# EAGLE design PSPS_AVNC_SRD_central-2020-10-21 (FABRICATED) (EAGLE 9.6.2)
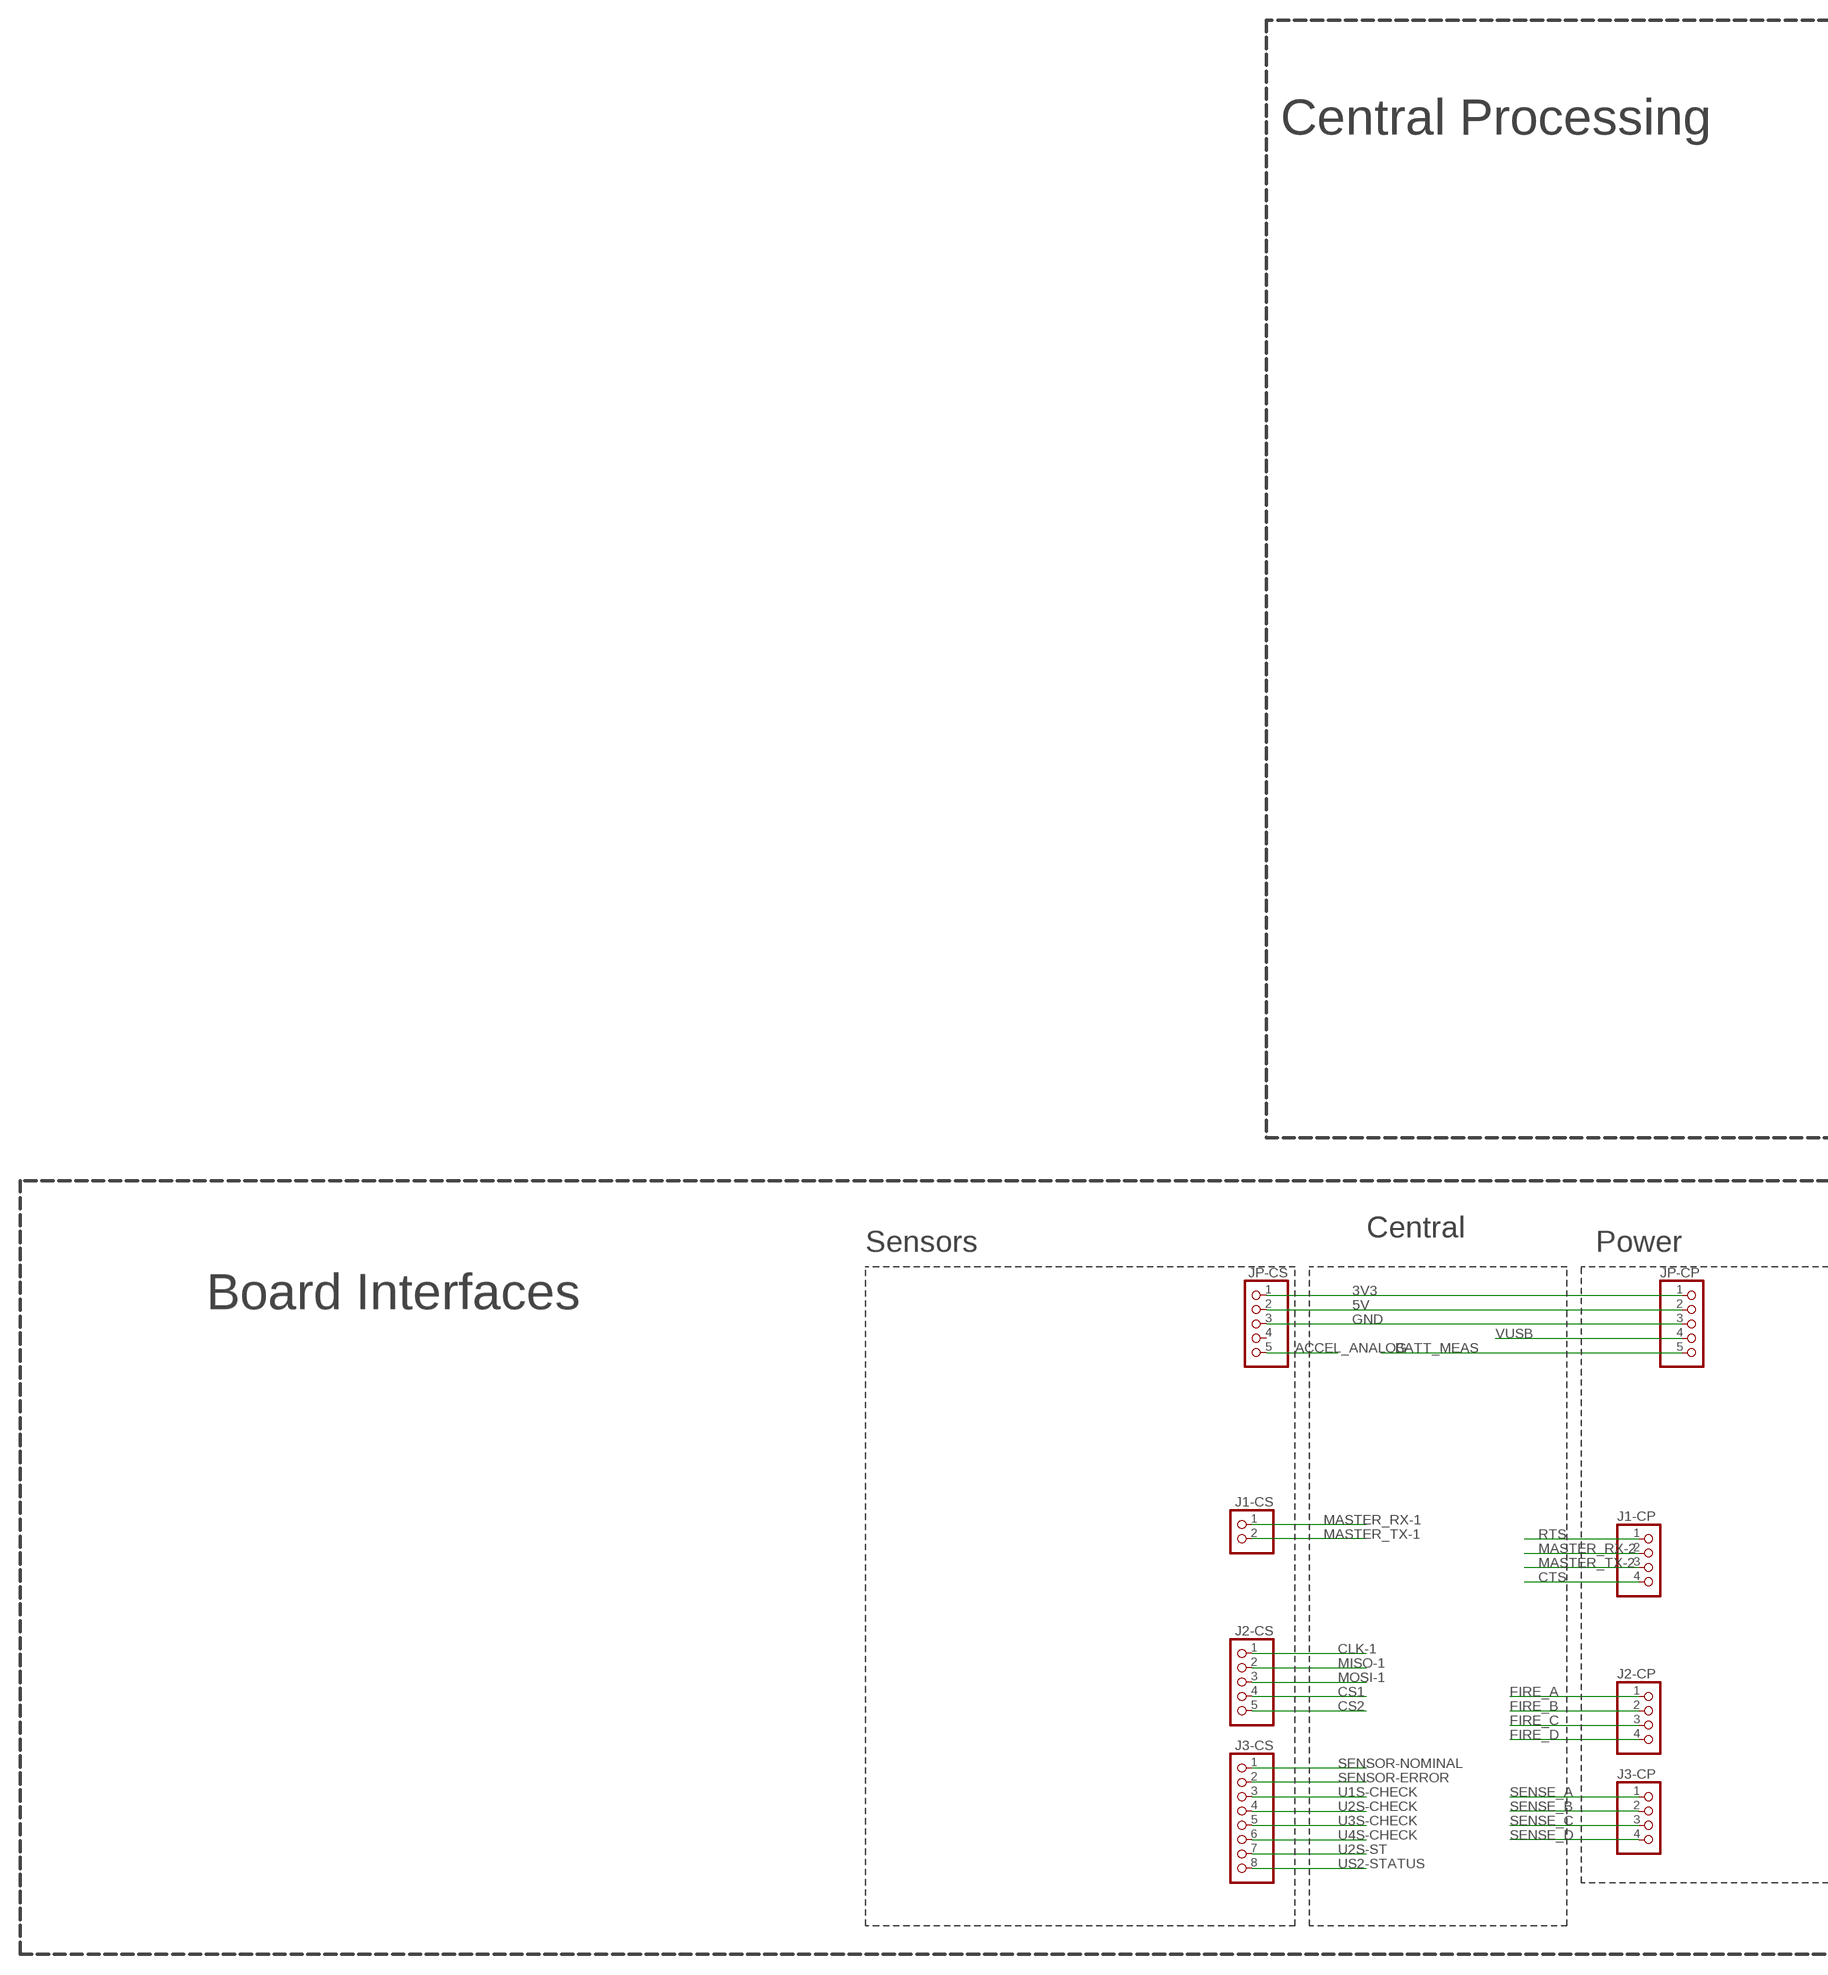
[diagram p0: schematic, sheet 1, part 1 of 2]
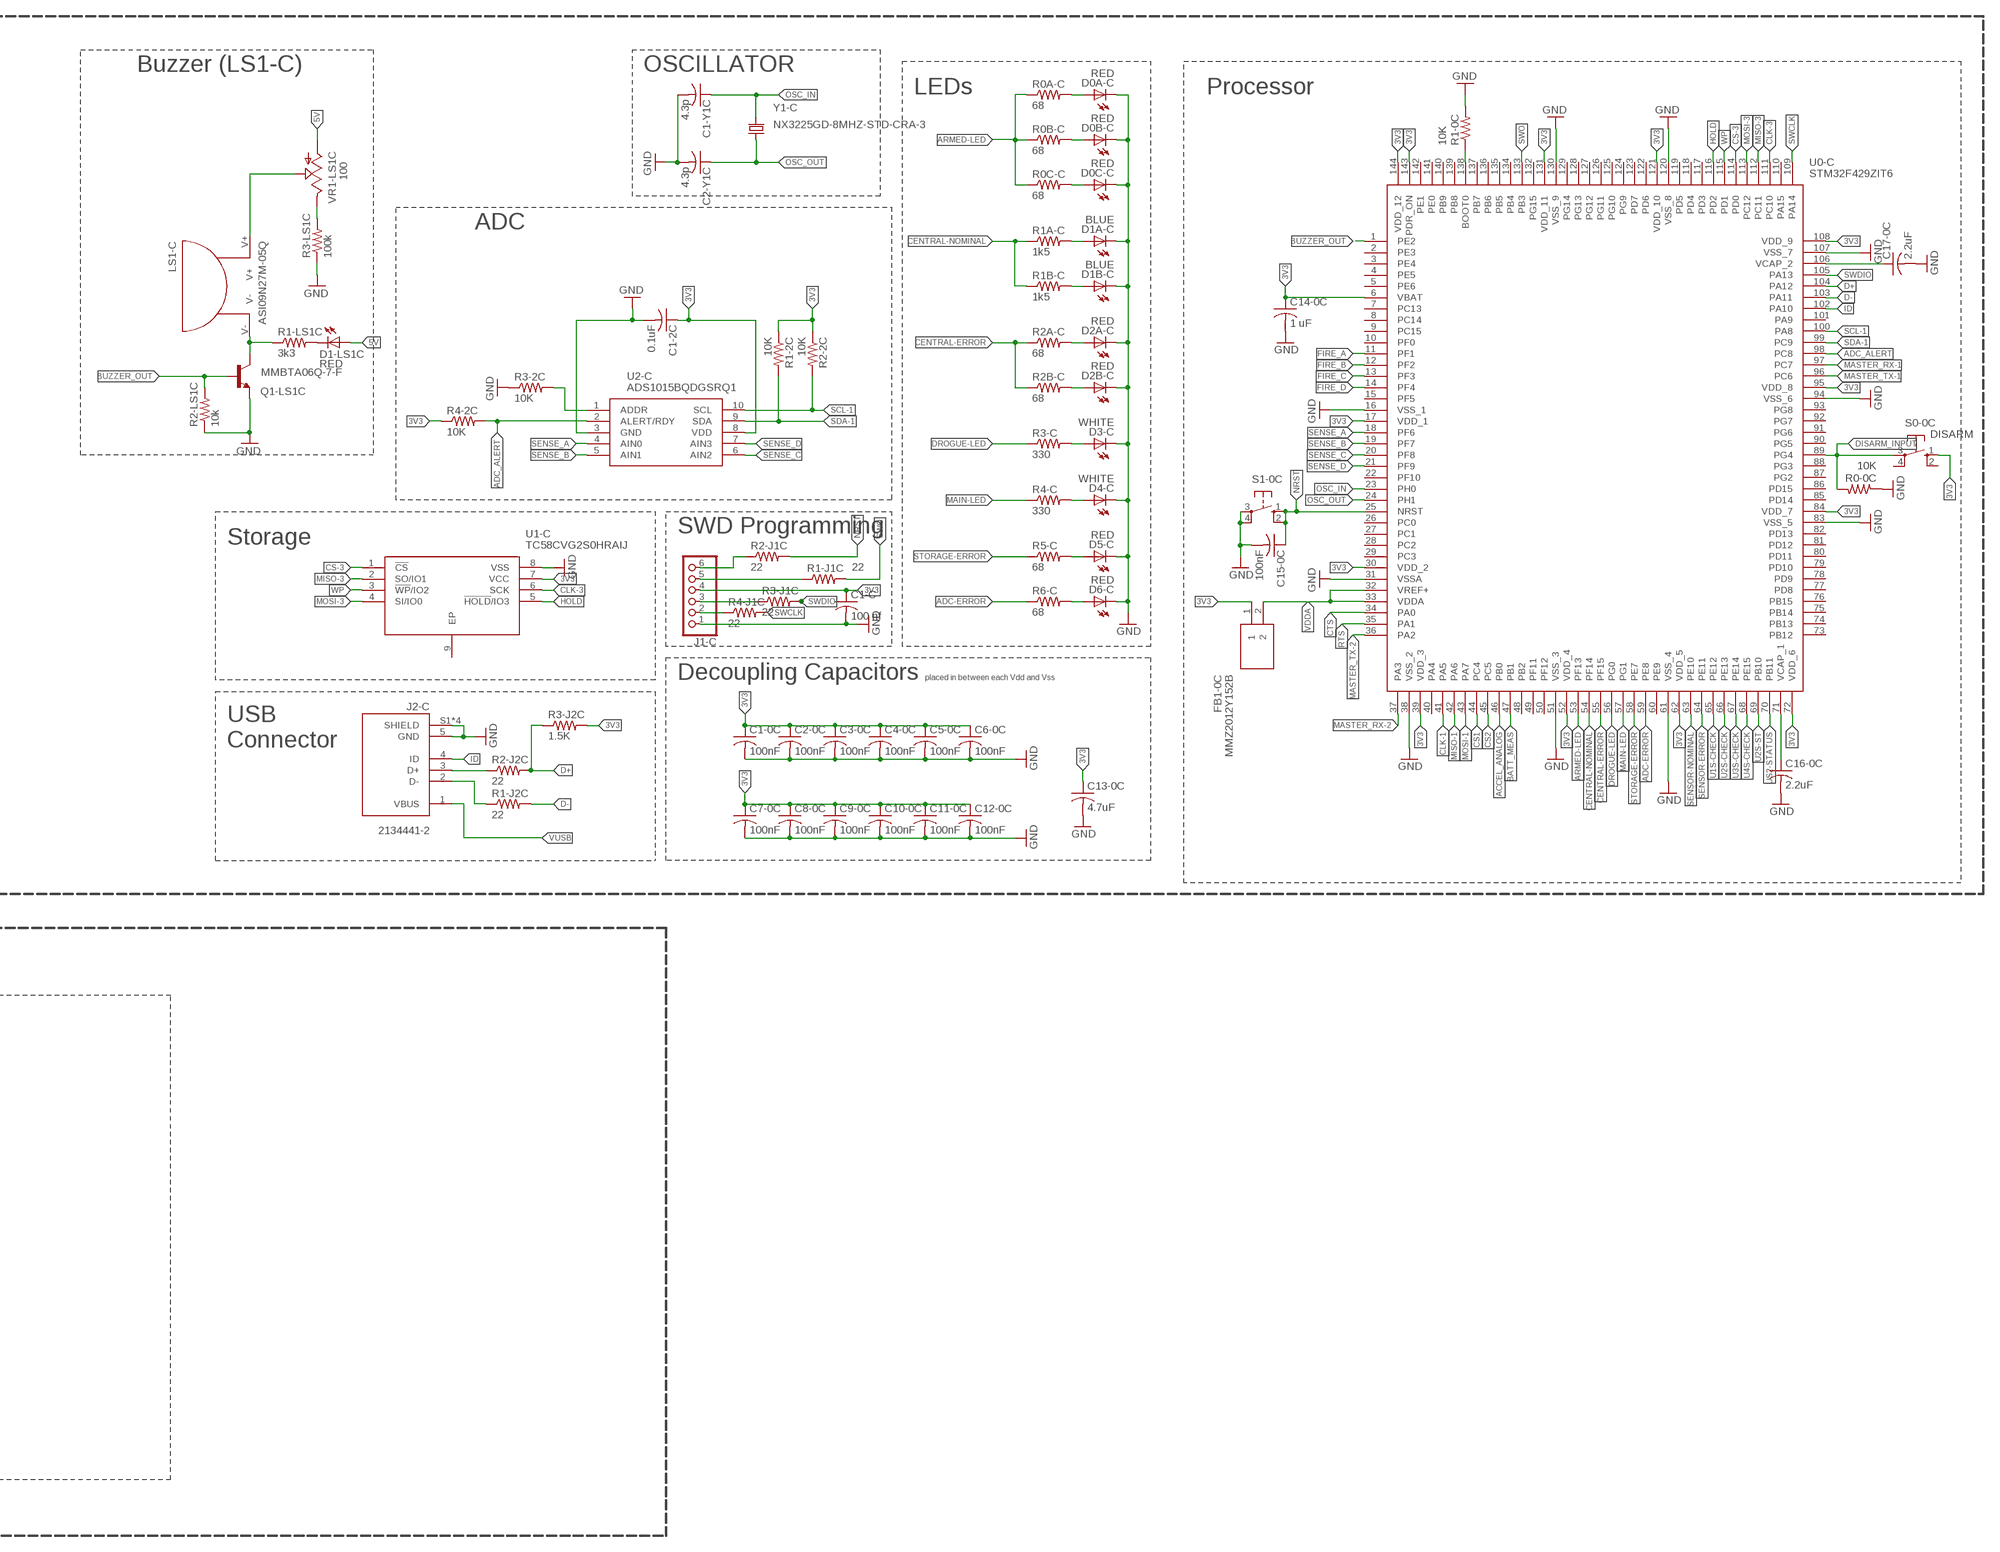
[diagram p1: schematic, sheet 1, part 2 of 2]

## Parts
C1-0C  100nF  C-USC0805  [C0805]
C1-2C  0.1uF  C-USC0805  [C0805]
C1-C  100 nf  C-USC0805  [C0805]
C1-Y1C  4.3p  C-USC0805  [C0805]
C2-0C  100nF  C-USC0805  [C0805]
C2-Y1C  4.3p  C-USC0805  [C0805]
C3-0C  100nF  C-USC0805  [C0805]
C4-0C  100nF  C-USC0805  [C0805]
C5-0C  100nF  C-USC0805  [C0805]
C6-0C  100nF  C-USC0805  [C0805]
C7-0C  100nF  C-USC0805  [C0805]
C8-0C  100nF  C-USC0805  [C0805]
C9-0C  100nF  C-USC0805  [C0805]
C10-0C  100nF  C-USC0805  [C0805]
C11-0C  100nF  C-USC0805  [C0805]
C12-0C  100nF  C-USC0805  [C0805]
C13-0C  4.7uF  C-USC0805  [C0805]
C14-0C  1 uF  C-USC0805  [C0805]
C15-0C  100nF  C-USC0805  [C0805]
C16-0C  2.2uF  C-USC0805  [C0805]
C17-0C  2.2uF  C-USC0805  [C0805]
D0A-C  RED  LEDCHIPLED_0805  [CHIPLED_0805]
D0B-C  RED  LEDCHIPLED_0805  [CHIPLED_0805]
D0C-C  RED  LEDCHIPLED_0805  [CHIPLED_0805]
D1-LS1C  RED  LEDCHIPLED_0805  [CHIPLED_0805]
D1A-C  BLUE  LEDCHIPLED_0805  [CHIPLED_0805]
D1B-C  BLUE  LEDCHIPLED_0805  [CHIPLED_0805]
D2A-C  RED  LEDCHIPLED_0805  [CHIPLED_0805]
D2B-C  RED  LEDCHIPLED_0805  [CHIPLED_0805]
D3-C  WHITE  LEDCHIPLED_0805  [CHIPLED_0805]
D4-C  WHITE  LEDCHIPLED_0805  [CHIPLED_0805]
D5-C  RED  LEDCHIPLED_0805  [CHIPLED_0805]
D6-C  RED  LEDCHIPLED_0805  [CHIPLED_0805]
FB1-0C  MMZ2012Y152B  [BEADC2012X105N]
J1-C  PINHD-1X6  [1X06]
J1-CP  PINHD-1X4  [1X04]
J1-CS  PINHD-1X2  [1X02]
J2-C  2134441-2  [TE_2134441-2]
J2-CP  PINHD-1X4  [1X04]
J2-CS  PINHD-1X5  [1X05]
J3-CP  PINHD-1X4  [1X04]
J3-CS  PINHD-1X8  [1X08]
JP-CP  PINHD-1X5  [1X05]
JP-CS  PINHD-1X5  [1X05]
LS1-C  ASI09N27M-05Q  [ASI09N27M-05Q]
Q1-LS1C  MMBTA06Q-7-F  NPN_TRANSISTOR  [SOT23]
R0-0C  10K  R-US_R0805  [R0805]
R0A-C  68  R-US_M0805  [M0805]
R0B-C  68  R-US_M0805  [M0805]
R0C-C  68  R-US_M0805  [M0805]
R1-0C  10K  R-US_R0805  [R0805]
R1-2C  10K  R-US_R0805  [R0805]
R1-J1C  22  R-US_M0805  [M0805]
R1-J2C  22  R-US_M0805  [M0805]
R1-LS1C  3k3  R-US_R0805  [R0805]
R1A-C  1k5  R-US_M0805  [M0805]
R1B-C  1k5  R-US_M0805  [M0805]
R2-2C  10K  R-US_R0805  [R0805]
R2-J1C  22  R-US_M0805  [M0805]
R2-J2C  22  R-US_M0805  [M0805]
R2-LS1C  10k  R-US_R0805  [R0805]
R2A-C  68  R-US_M0805  [M0805]
R2B-C  68  R-US_M0805  [M0805]
R3-2C  10K  R-US_R0805  [R0805]
R3-C  330  R-US_M0805  [M0805]
R3-J1C  22  R-US_M0805  [M0805]
R3-J2C  1.5K  R-US_M0805  [M0805]
R3-LS1C  100k  R-US_R0805  [R0805]
R4-2C  10K  R-US_R0805  [R0805]
R4-C  330  R-US_M0805  [M0805]
R4-J1C  22  R-US_M0805  [M0805]
R5-C  68  R-US_M0805  [M0805]
R6-C  68  R-US_M0805  [M0805]
S0-0C  DISARM  10-XX  [B3F-10XX]
S1-0C  10-XX  [B3F-10XX]
U0-C  STM32F429ZIT6  [QFP50P2200X2200X160-144N]
U1-C  TC58CVG2S0HRAIJ  [SON127P800X600X80-9N]
U2-C  ADS1015BQDGSRQ1  [SOP50P490X110-10N]
VR1-LS1C  100  TRIM_US-LI10  [LI10]
Y1-C  NX3225GD-8MHZ-STD-CRA-3  NX3225GD  [NX3225GD]

## Nets
3V3: C1-0C.1 C1-2C.1 C1-C.1 C2-0C.1 C3-0C.1 C4-0C.1 C5-0C.1 C6-0C.1 C7-0C.1 C8-0C.1 C9-0C.1 C10-0C.1 C11-0C.1 C12-0C.1 C13-0C.1 C14-0C.1 FB1-0C.1 J1-C.4 JP-CP.1 JP-CS.1 R1-2C.1 R2-2C.1 R3-J2C.2 R4-2C.1 S0-0C.1(S) U0-C.6(VBAT) U0-C.17(VDD_1) U0-C.30(VDD_2) U0-C.39(VDD_3) U0-C.52(VDD_4) U0-C.62(VDD_5) U0-C.72(VDD_6) U0-C.84(VDD_7) U0-C.95(VDD_8) U0-C.108(VDD_9) U0-C.121(VDD_10) U0-C.131(VDD_11) U0-C.143(PDR_ON) U0-C.144(VDD_12) U1-C.7(VCC) U2-C.8(VDD)
5V: D1-LS1C.A JP-CP.2 JP-CS.2 VR1-LS1C.A
ACCEL_ANALOG: JP-CS.5 U0-C.46(PB0)
ADC-ERROR: R6-C.1 U0-C.59(PE8)
ADC_ALERT: R4-2C.2 U0-C.98(PC8) U2-C.2(ALERT/RDY)
ADDR: R3-2C.2 U2-C.1(ADDR)
ARMED-LED: R0A-C.1 R0B-C.1 R0C-C.1 U0-C.53(PF13)
BATT_MEAS: JP-CP.5 U0-C.47(PB1)
BOOT0: R1-0C.1 U0-C.138(BOOT0)
BUZZER_OUT: Q1-LS1C.1(B) R2-LS1C.2 U0-C.1(PE2)
CENTRAL-ERROR: R2A-C.1 R2B-C.1 U0-C.55(PF15)
CENTRAL-NOMINAL: R1A-C.1 R1B-C.1 U0-C.54(PF14)
CLK-1: J2-CS.1 U0-C.41(PA5)
CLK-3: U0-C.111(PC10) U1-C.6(SCK)
CS1: J2-CS.4 U0-C.44(PC4)
CS2: J2-CS.5 U0-C.45(PC5)
CS-3: U0-C.114(PD0) U1-C.1(!CS)
CTS: J1-CP.4 U0-C.34(PA0)
D1-LS1C_R1-LS1C: D1-LS1C.C R1-LS1C.2
D+: R2-J2C.2 R3-J2C.1 U0-C.104(PA12)
D+_R2-J1C: J2-C.3(D+) R2-J2C.1
D-: R1-J2C.2 U0-C.103(PA11)
D-_R1-J1C: J2-C.2(D-) R1-J2C.1
DISARM_INPUT: R0-0C.2 S0-0C.3(P) U0-C.89(PG4)
DROGUE-LED: R3-C.1 U0-C.56(PG0)
FIRE_A: J2-CP.1 U0-C.11(PF1)
FIRE_B: J2-CP.2 U0-C.12(PF2)
FIRE_C: J2-CP.3 U0-C.13(PF3)
FIRE_D: J2-CP.4 U0-C.14(PF4)
GND: C1-0C.2 C1-2C.2 C1-C.2 C1-Y1C.2 C2-0C.2 C2-Y1C.2 C3-0C.2 C4-0C.2 C5-0C.2 C6-0C.2 C7-0C.2 C8-0C.2 C9-0C.2 C10-0C.2 C11-0C.2 C12-0C.2 C13-0C.2 C14-0C.2 C15-0C.2 C16-0C.2 C17-0C.2 D0A-C.C D0B-C.C D0C-C.C D1A-C.C D1B-C.C D2A-C.C D2B-C.C D3-C.C D4-C.C D5-C.C D6-C.C J1-C.1 J2-C.5(GND) J2-C.S1(SHIELD) J2-C.S2(SHIELD) J2-C.S3(SHIELD) J2-C.S4(SHIELD) JP-CP.3 JP-CS.3 Q1-LS1C.3(E) R0-0C.1 R1-0C.2 R2-LS1C.1 R3-2C.1 R3-LS1C.1 S1-0C.3(P) S1-0C.4(P1) U0-C.16(VSS_1) U0-C.31(VSSA) U0-C.38(VSS_2) U0-C.51(VSS_3) U0-C.61(VSS_4) U0-C.83(VSS_5) U0-C.94(VSS_6) U0-C.107(VSS_7) U0-C.120(VSS_8) U0-C.130(VSS_9) U1-C.8(VSS) U2-C.3(GND)
HOLD: U0-C.116(PD2) U1-C.5(!HOLD!/IO3)
ID: J2-C.4(ID) U0-C.102(PA10)
J1-C_R1-J1C: J1-C.5 R1-J1C.1
J1-C_R2-J1C: J1-C.6 R2-J1C.1
J1-C_R3-J1C: J1-C.3 R3-J1C.1
J1-C_R4-J1C: J1-C.2 R4-J1C.1
LS1-C_Q1-LS1C: LS1-C.V- Q1-LS1C.2(C) R1-LS1C.1
MAIN-LED: R4-C.1 U0-C.57(PG1)
MASTER_RX-1: J1-CS.1 U0-C.97(PC7)
MASTER_RX-2: J1-CP.2 U0-C.37(PA3)
MASTER_TX-1: J1-CS.2 U0-C.96(PC6)
MASTER_TX-2: J1-CP.3 U0-C.36(PA2)
MISO-1: J2-CS.2 U0-C.42(PA6)
MISO-3: U0-C.112(PC11) U1-C.2(SO/IO1)
MOSI-1: J2-CS.3 U0-C.43(PA7)
MOSI-3: U0-C.113(PC12) U1-C.4(SI/IO0)
NRST: C15-0C.1 R2-J1C.2 S1-0C.1(S) S1-0C.2(S1) U0-C.25(NRST)
OSC_IN: C1-Y1C.1 U0-C.23(PH0) Y1-C.P$2
OSC_OUT: C2-Y1C.1 U0-C.24(PH1) Y1-C.P$1
R0A-C_D0A-C: D0A-C.A R0A-C.2
R0B-C_D0B-C: D0B-C.A R0B-C.2
R0C-C_D0C-C: D0C-C.A R0C-C.2
R1A-C_D1A-C: D1A-C.A R1A-C.2
R1B-C_D1B-C: D1B-C.A R1B-C.2
R2-LS1C_LS1C: LS1-C.V+ VR1-LS1C.S
R2A-C_D2A-C: D2A-C.A R2A-C.2
R2B-C_D2B-C: D2B-C.A R2B-C.2
R3-C_D3-C: D3-C.A R3-C.2
R4-C_D4-C: D4-C.A R4-C.2
R5-C_D5-C: D5-C.A R5-C.2
R6-C_D6-C: D6-C.A R6-C.2
RTS: J1-CP.1 U0-C.35(PA1)
SCL-1: R2-2C.2 U0-C.100(PA8) U2-C.10(SCL)
SDA-1: R1-2C.2 U0-C.99(PC9) U2-C.9(SDA)
SENSE_A: J3-CP.1 U0-C.18(PF6) U2-C.4(AIN0)
SENSE_B: J3-CP.2 U0-C.19(PF7) U2-C.5(AIN1)
SENSE_C: J3-CP.3 U0-C.20(PF8) U2-C.6(AIN2)
SENSE_D: J3-CP.4 U0-C.21(PF9) U2-C.7(AIN3)
SENSOR-ERROR: J3-CS.2 U0-C.64(PE11)
SENSOR-NOMINAL: J3-CS.1 U0-C.63(PE10)
STORAGE-ERROR: R5-C.1 U0-C.58(PE7)
SWCLK: R4-J1C.2 U0-C.109(PA14)
SWDIO: R3-J1C.2 U0-C.105(PA13)
SWO: R1-J1C.2 U0-C.133(PB3)
U1S-CHECK: J3-CS.3 U0-C.65(PE12)
U2S-CHECK: J3-CS.4 U0-C.66(PE13)
U2S-ST: J3-CS.7 U0-C.69(PB10)
U3S-CHECK: J3-CS.5 U0-C.67(PE14)
U4S-CHECK: J3-CS.6 U0-C.68(PE15)
US2-STATUS: J3-CS.8 U0-C.70(PB11)
VCAP_1: C16-0C.1 U0-C.71(VCAP_1)
VCAP_2: C17-0C.1 U0-C.106(VCAP_2)
VDDA: FB1-0C.2 U0-C.32(VREF+) U0-C.33(VDDA)
VR1-LS1C_R3-LS1C: R3-LS1C.2 VR1-LS1C.E
VUSB: J2-C.1(VBUS) JP-CP.4
WP: U0-C.115(PD1) U1-C.3(!WP!/IO2)
Unconnected: JP-CS.4 S0-0C.2(S1) S0-0C.4(P1) U0-C.2(PE3) U0-C.3(PE4) U0-C.4(PE5) U0-C.5(PE6) U0-C.7(PC13) U0-C.8(PC14) U0-C.9(PC15) U0-C.10(PF0) U0-C.15(PF5) U0-C.22(PF10) U0-C.26(PC0) U0-C.27(PC1) U0-C.28(PC2) U0-C.29(PC3) U0-C.40(PA4) U0-C.48(PB2) U0-C.49(PF11) U0-C.50(PF12) U0-C.60(PE9) U0-C.73(PB12) U0-C.74(PB13) U0-C.75(PB14) U0-C.76(PB15) U0-C.77(PD8) U0-C.78(PD9) U0-C.79(PD10) U0-C.80(PD11) U0-C.81(PD12) U0-C.82(PD13) U0-C.85(PD14) U0-C.86(PD15) U0-C.87(PG2) U0-C.88(PG3) U0-C.90(PG5) U0-C.91(PG6) U0-C.92(PG7) U0-C.93(PG8) U0-C.101(PA9) U0-C.110(PA15) U0-C.117(PD3) U0-C.118(PD4) U0-C.119(PD5) U0-C.122(PD6) U0-C.123(PD7) U0-C.124(PG9) U0-C.125(PG10) U0-C.126(PG11) U0-C.127(PG12) U0-C.128(PG13) U0-C.129(PG14) U0-C.132(PG15) U0-C.134(PB4) U0-C.135(PB5) U0-C.136(PB6) U0-C.137(PB7) U0-C.139(PB8) U0-C.140(PB9) U0-C.141(PE0) U0-C.142(PE1) U1-C.9(EP)

## Notes on the sheet
- Buzzer (LS1-C) | OSCILLATOR
- LEDs | Processor
- Central Processing
- ADC
- SWD Programming
- Storage
- Decoupling Capacitors | placed in between each Vdd and Vss
- USB 
  Connector
- Central
- Sensors | Power
- Board Interfaces

## Library data of the parts
C1-0C C1-2C C1-C C1-Y1C C2-0C C2-Y1C C3-0C C4-0C C5-0C C6-0C C7-0C C8-0C C9-0C C10-0C C11-0C C12-0C C13-0C C14-0C C15-0C C16-0C C17-0C = rcl:C-US: CAPACITOR, American symbol; SPICEPREFIX: C
D0A-C D0B-C D0C-C D1-LS1C D1A-C D1B-C D2A-C D2B-C D3-C D4-C D5-C D6-C = adafruit:LED: LED OSRAM: - CHIPLED LG R971, LG N971, LY N971, LG Q971, LY Q971, LO R971, LY R971 LH N974, LH R974 LS Q976, LO Q976, LY Q976 LO Q996 - Hyper CHIPLED LW Q18S LB Q993, LB Q99A, LB R99A - SideLED LS A670, LO A670, LY A670, LG A670, LP A670 LB A673, LV A673, LT A673, LW A673 LH A674 LY A675 LS A676, LA A676, LO A676, LY A676, LW A676 LS A679, LY A679, LG A679 - Hyper Micro SIDELED® LS Y876, LA Y876, LO Y876, LY Y876 LT Y87S - SmartLED LW L88C, LW L88S LB L89C, LB L89S, LG L890 LS L89K, LO L89K, LY L89K LS L896, LA L896, LO L896, LY L896 - TOPLED LS T670, LO T670, LY T670, LG T670, LP T670 LSG T670, LSP T670, LSY T670, LOP T670, LYG T670 LG T671, LOG T671, LSG T671 LB T673, LV T673, LT T673, LW T673 LH T674 LS T676, LA T676, LO T676, LY T676, LB T676, LH T676, LSB T676, LW T676 LB T67C, LV T67C, LT T67C, LS T67K, LO T67K, LY T67K, LW E67C LS E67B, LA E67B, LO E67B, LY E67B, LB E67C, LV E67C, LT E67C LW T67C LS T679, LY T679, LG T679 LS T770, LO T770, LY T770, LG T770, LP T770 LB T773, LV T773, LT T773, LW T773 LH T774 LS E675, LA E675, LY E675, LS T675 LS T776, LA T776, LO T776, LY T776, LB T776 LHGB T686 LT T68C, LB T68C - Hyper Mini TOPLED® LB M676 - Mini TOPLED Santana® LG M470 LS M47K, LO M47K, LY M47K Source: http://www.osram.convergy.de/
FB1-0C = SamacSys_Parts:MMZ2012Y152B: Ferrite bead SMD 1500Ohm 500mA TDK Ferrite Bead (Chip Bead), 2 x 1.25 x 0.85mm (0805) Source: Datasheet <https://componentsearchengine.com/Datasheets/1/MMZ2012Y152B.pdf>; DESCRIPTION: Ferrite bead SMD 1500Ohm 500mA TDK Ferrite Bead (Chip Bead), 2 x 1.25 x 0.85mm (0805); HEIGHT: 1.05mm; MANUFACTURER_NAME: TDK; MANUFACTURER_PART_NUMBER: MMZ2012Y152B; MOUSER_PART_NUMBER: 810-MMZ2012Y152B; MOUSER_PRICE-STOCK: https://www.mouser.com/Search/Refine.aspx?Keyword=810-MMZ2012Y152B
J1-C = pinhead:PINHD-1X6: PIN HEADER
J1-CP J2-CP J3-CP = pinhead:PINHD-1X4: PIN HEADER
J1-CS = pinhead:PINHD-1X2: PIN HEADER
J2-C = 2134441-2:2134441-2: Conn Micro USB RCP 5 POS 0.65mm Solder RA SMD 5 Terminal 1 Port T/R; COMMENT: 2134441-2; DESCRIPTION: Conn Micro USB RCP 5 POS 0.65mm Solder RA SMD 5 Terminal 1 Port T/R; DIGI-KEY_PART_NUMBER: A118104CT-ND; DIGI-KEY_PURCHASE_URL: https://www.digikey.com/product-detail/en/te-connectivity-amp-connectors/2134441-2/A118104CT-ND/4729911?utm_source=snapeda&utm_medium=aggregator&utm_campaign=symbol; MF: TE Connectivity; MP: 2134441-2; PACKAGE: None; TE_PURCHASE_URL: https://www.te.com/usa-en/product-2134441-2.html?te_bu=Cor&te_type=disp&te_campaign=seda_glo_cor-seda-global-disp-prtnr-fy19-seda-model-bom-cta_sma-317_1&elqCampaignId=32493
J2-CS JP-CP JP-CS = pinhead:PINHD-1X5: PIN HEADER
J3-CS = pinhead:PINHD-1X8: PIN HEADER
LS1-C = Computer2:ASI09N27M-05Q
Q1-LS1C = Flight Computer Parts:NPN_TRANSISTOR
R0-0C R0A-C R0B-C R0C-C R1-0C R1-2C R1-J1C R1-J2C R1A-C R1B-C R2-2C R2-J1C R2-J2C R2A-C R2B-C R3-2C R3-C R3-J1C R3-J2C R4-2C R4-C R4-J1C R5-C R6-C = rcl:R-US_: RESISTOR, American symbol; SPICEPREFIX: R
R1-LS1C R2-LS1C R3-LS1C = resistor:R-US_: RESISTOR, American symbol
S0-0C S1-0C = switch-omron:10-XX: OMRON SWITCH; MPN: B3F-1000; OC_FARNELL: 176432; OC_NEWARK: 36M3542
U0-C = SamacSys_Parts:STM32F429ZIT6: 32-Bit MCU+FPU M4 2MB LCD-TFT LQFP144 STMicroelectronics STM32F429ZIT6, 32bit ARM Cortex M4 MCU, 180MHz, 2048 kB Flash, 144-Pin LQFP Source: Datasheet <https://componentsearchengine.com/Datasheets/1/STM32F429ZIT6.pdf>; DESCRIPTION: 32-Bit MCU+FPU M4 2MB LCD-TFT LQFP144 STMicroelectronics STM32F429ZIT6, 32bit ARM Cortex M4 MCU, 180MHz, 2048 kB Flash, 144-Pin LQFP; HEIGHT: 1.6mm; MANUFACTURER_NAME: STMicroelectronics; MANUFACTURER_PART_NUMBER: STM32F429ZIT6; MOUSER_PART_NUMBER: 511-STM32F429ZIT6; MOUSER_PRICE-STOCK: https://www.mouser.com/Search/Refine.aspx?Keyword=511-STM32F429ZIT6
U1-C = SamacSys_Parts:TC58CVG2S0HRAIJ: NAND Flash 4G-bit 128M X 8bit Serial 8-Pin WSON Source: Datasheet <https://business.kioxia.com/en-us/memory/detail.TC58CVG2S0HRAIJ.html>; DESCRIPTION: NAND Flash 4G-bit 128M X 8bit Serial 8-Pin WSON; HEIGHT: 0.8mm; MANUFACTURER_NAME: Kioxia America; MANUFACTURER_PART_NUMBER: TC58CVG2S0HRAIJ; MOUSER_PART_NUMBER: 757-TC58CVG2S0HRAIJ; MOUSER_PRICE-STOCK: https://www.mouser.co.uk/ProductDetail/Kioxia-America/TC58CVG2S0HRAIJ?qs=OlC7AqGiEDkQEWU%2FaAG3Ug%3D%3D
U2-C = SamacSys_Parts:ADS1015BQDGSRQ1: Automotive 12-Bit 3.3kSPS 4-Ch Delta-Sigma ADC With PGA, Oscillator, VREF, Comparator, and I2C Source: Datasheet <http://www.ti.com/lit/gpn/ads1015-q1>; DESCRIPTION: Automotive 12-Bit 3.3kSPS 4-Ch Delta-Sigma ADC With PGA, Oscillator, VREF, Comparator, and I2C; HEIGHT: 1.1mm; MANUFACTURER_NAME: Texas Instruments; MANUFACTURER_PART_NUMBER: ADS1015BQDGSRQ1; MOUSER_PART_NUMBER: 595-ADS1015BQDGSRQ1; MOUSER_PRICE-STOCK: https://www.mouser.com/Search/Refine.aspx?Keyword=595-ADS1015BQDGSRQ1
VR1-LS1C = pot:TRIM_US-: POTENTIOMETER
Y1-C = MarkParts:NX3225GD

## Board
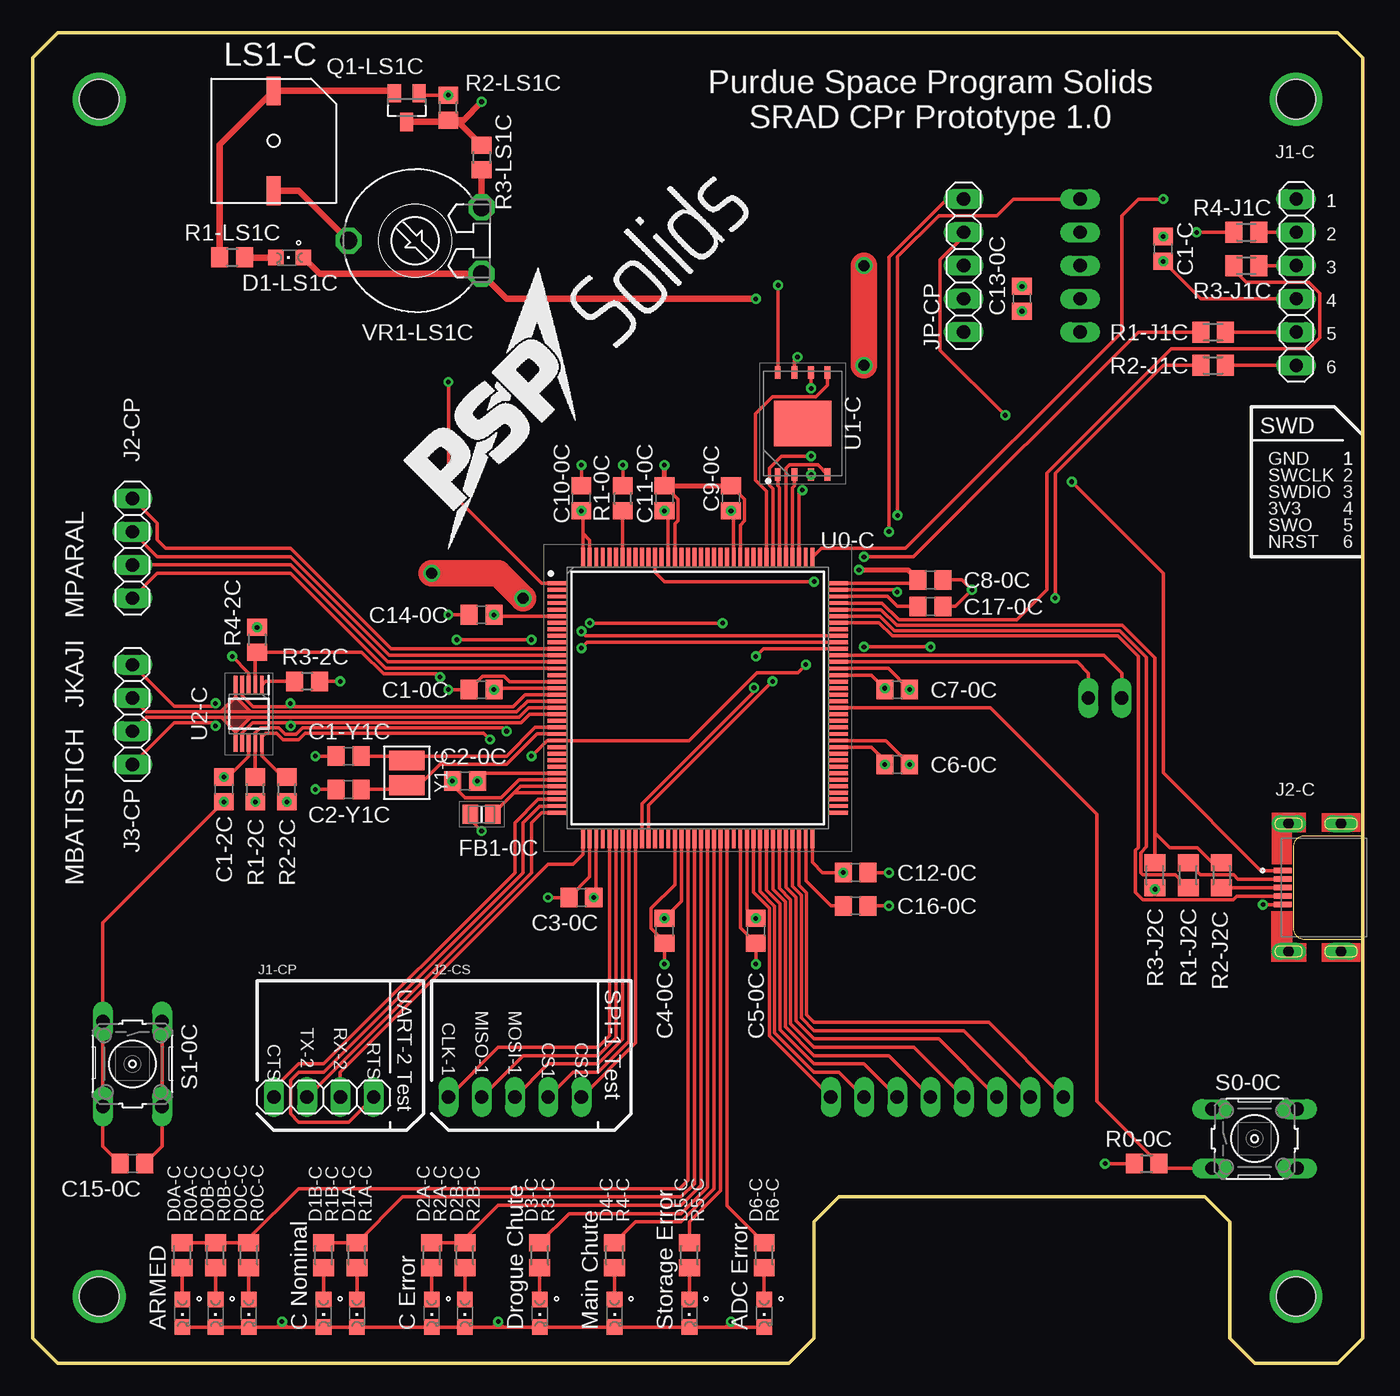
[diagram p2: board, top side]
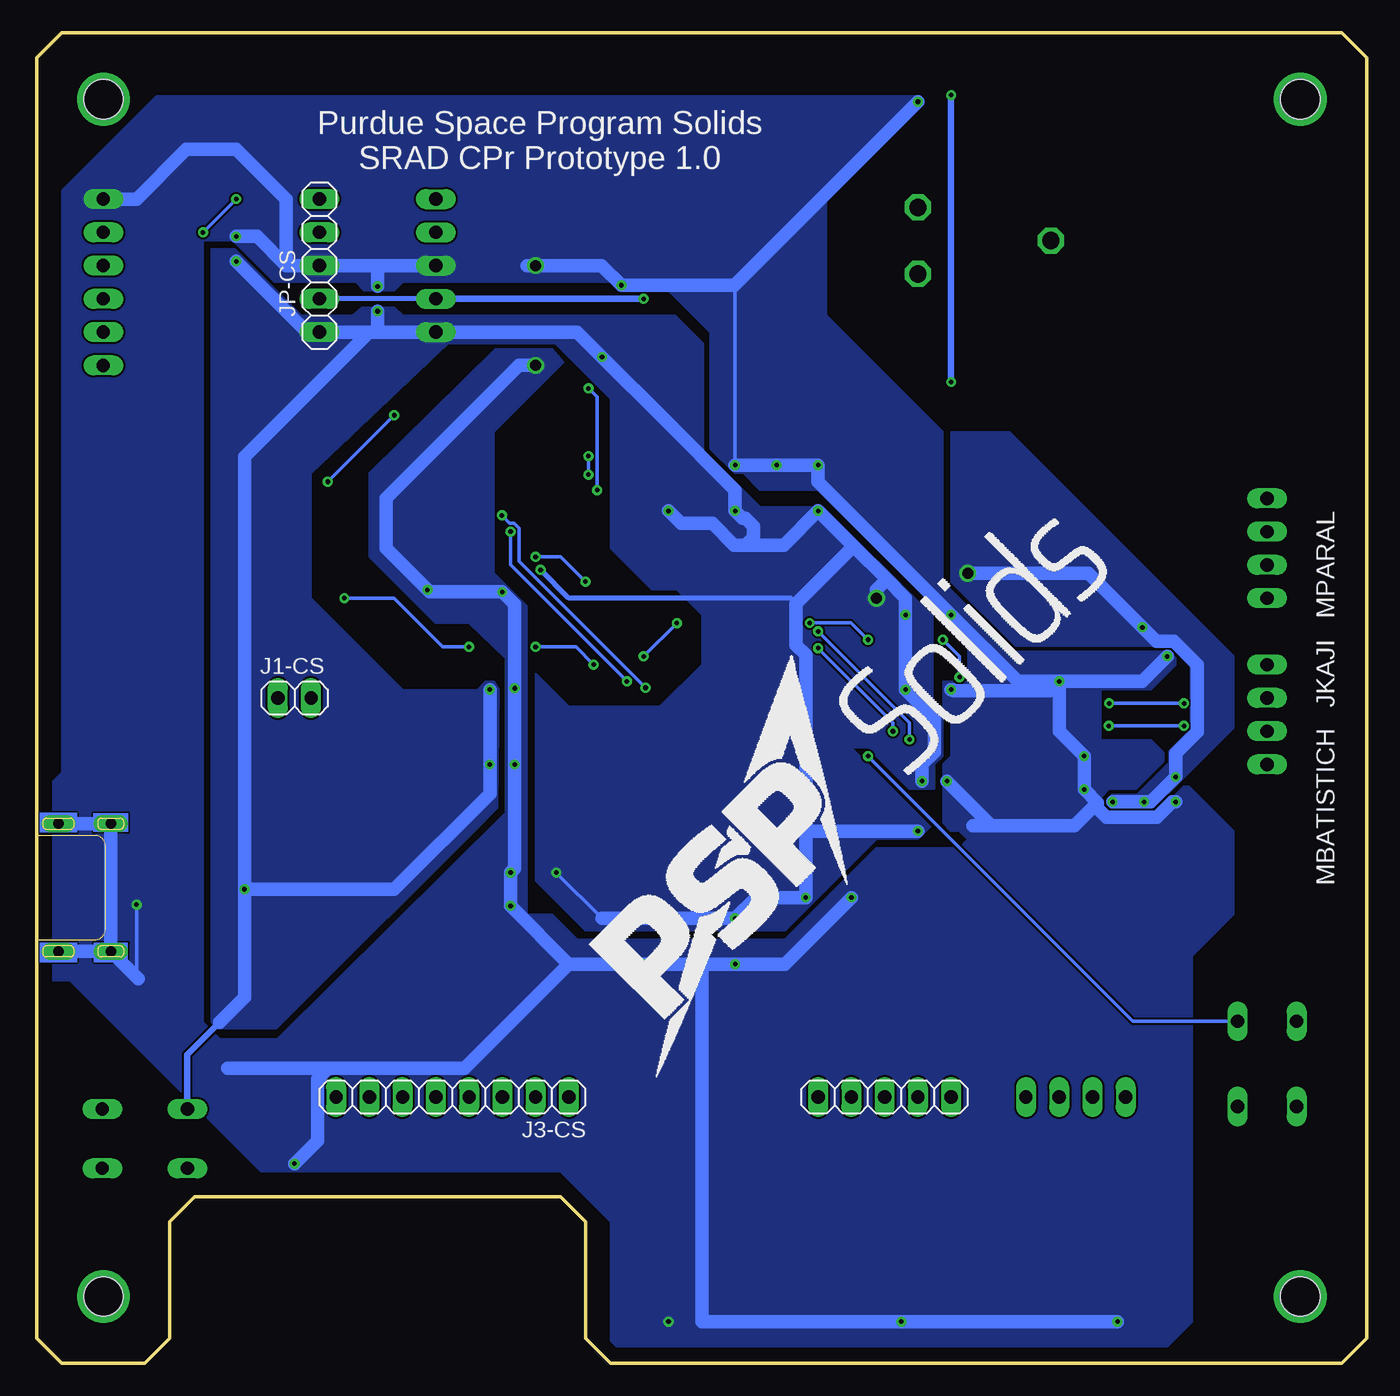
[diagram p3: board, bottom side, seen from below]

Size 101.6 x 101.6 mm. Coordinates in mm from the lower left corner, seen from the top.
Outline: 0,1.91 1.91,0 57.78,0 59.69,1.91 59.69,10.79 61.59,12.7 89.53,12.7 91.44,10.79 91.44,1.91 93.34,0 99.69,0 101.6,1.91 101.6,99.69 99.69,101.6 1.91,101.6 0,99.69 0,1.91
Copper layers (1*16): Top 0.035mm / dielectric 1.5mm / Bottom 0.035mm
Design rules "default": minimum track width 6mil, minimum drill 0.35mm, track to track 6mil, track to pad 6mil, pad to pad 6mil, via to via 6mil, smd to smd 6mil, copper to edge 40mil, drill to drill 6mil, minimum pad ring 10mil, minimum via ring 8mil, stop-mask expansion 4mil, vias tented up to drill 0mil, thermal gap 10mil
Holes 3 mm at 5.08,96.52 96.52,96.52 96.52,5.08 5.08,5.08

### Footprints (pad centres in the part's own frame; a part is rotated, then mirrored left to right if it is on the bottom)
C0805 = smd 1.3 x 1.5: 1 -0.95,0; 2 0.95,0
CHIPLED_0805 = smd 1.2 x 1.2: A 0,-1.05; C 0,1.05
BEADC2012X105N = smd 1.2 x 1.45: 1 -0.85,0; 2 0.85,0
1X06 = drill 1.016 long: 1 -6.35,0; 2 -3.81,0; 3 -1.27,0; 4 1.27,0; 5 3.81,0; 6 6.35,0
1X04 = drill 1.016 long: 1 -3.81,0; 2 -1.27,0; 3 1.27,0; 4 3.81,0
1X02 = drill 1.016 long: 1 -1.27,0; 2 1.27,0
TE_2134441-2 = smd 1.4 x 0.4: 1 -4.45,1.3; 2 -4.45,0.65; 3 -4.45,0; 4 -4.45,-0.65; 5 -4.45,-1.3 | drill 0.8 pad 1.25 long: S1 -4,-4.875; S2 0,-4.875; S3 0,4.875; S4 -4,4.875
1X05 = drill 1.016 long: 1 -5.08,0; 2 -2.54,0; 3 0,0; 4 2.54,0; 5 5.08,0
1X08 = drill 1.016 long: 1 -8.89,0; 2 -6.35,0; 3 -3.81,0; 4 -1.27,0; 5 1.27,0; 6 3.81,0; 7 6.35,0; 8 8.89,0
ASI09N27M-05Q = smd 2.184 x 1.067: V+ 3.81,0; V- -3.81,0
SOT23 = smd 1 x 1.4: 1 -0.95,-1.1; 2 0.95,-1.1; 3 0,1.1
R0805 = smd 1.3 x 1.5: 1 -0.95,0; 2 0.95,0
M0805 = smd 1.3 x 1.6: 1 -0.95,0; 2 0.95,0
B3F-10XX = drill 1.016 long: 1 -3.251,2.261; 2 3.251,2.261; 3 -3.251,-2.261; 4 3.251,-2.261
QFP50P2200X2200X160-144N = smd 1.475 x 0.3: 1 -10.738,8.75; 2 -10.738,8.25; 3 -10.738,7.75; 4 -10.738,7.25; 5 -10.738,6.75; 6 -10.738,6.25; 7 -10.738,5.75; 8 -10.738,5.25; 9 -10.738,4.75; 10 -10.738,4.25; 11 -10.738,3.75; 12 -10.738,3.25; 13 -10.738,2.75; 14 -10.738,2.25; 15 -10.738,1.75; 16 -10.738,1.25; 17 -10.738,0.75; 18 -10.738,0.25; 19 -10.738,-0.25; 20 -10.738,-0.75; 21 -10.738,-1.25; 22 -10.738,-1.75; 23 -10.738,-2.25; 24 -10.738,-2.75; 25 -10.738,-3.25; 26 -10.738,-3.75; 27 -10.738,-4.25; 28 -10.738,-4.75; 29 -10.738,-5.25; 30 -10.738,-5.75; 31 -10.738,-6.25; 32 -10.738,-6.75; 33 -10.738,-7.25; 34 -10.738,-7.75; 35 -10.738,-8.25; 36 -10.738,-8.75; 73 10.738,-8.75; 74 10.738,-8.25; 75 10.738,-7.75; 76 10.738,-7.25; 77 10.738,-6.75; 78 10.738,-6.25; 79 10.738,-5.75; 80 10.738,-5.25; 81 10.738,-4.75; 82 10.738,-4.25; 83 10.738,-3.75; 84 10.738,-3.25; 85 10.738,-2.75; 86 10.738,-2.25; 87 10.738,-1.75; 88 10.738,-1.25; 89 10.738,-0.75; 90 10.738,-0.25; 91 10.738,0.25; 92 10.738,0.75; 93 10.738,1.25; 94 10.738,1.75; 95 10.738,2.25; 96 10.738,2.75; 97 10.738,3.25; 98 10.738,3.75; 99 10.738,4.25; 100 10.738,4.75; 101 10.738,5.25; 102 10.738,5.75; 103 10.738,6.25; 104 10.738,6.75; 105 10.738,7.25; 106 10.738,7.75; 107 10.738,8.25; 108 10.738,8.75 | smd 0.3 x 1.475: 37 -8.75,-10.738; 38 -8.25,-10.738; 39 -7.75,-10.738; 40 -7.25,-10.738; 41 -6.75,-10.738; 42 -6.25,-10.738; 43 -5.75,-10.738; 44 -5.25,-10.738; 45 -4.75,-10.738; 46 -4.25,-10.738; 47 -3.75,-10.738; 48 -3.25,-10.738; 49 -2.75,-10.738; 50 -2.25,-10.738; 51 -1.75,-10.738; 52 -1.25,-10.738; 53 -0.75,-10.738; 54 -0.25,-10.738; 55 0.25,-10.738; 56 0.75,-10.738; 57 1.25,-10.738; 58 1.75,-10.738; 59 2.25,-10.738; 60 2.75,-10.738; 61 3.25,-10.738; 62 3.75,-10.738; 63 4.25,-10.738; 64 4.75,-10.738; 65 5.25,-10.738; 66 5.75,-10.738; 67 6.25,-10.738; 68 6.75,-10.738; 69 7.25,-10.738; 70 7.75,-10.738; 71 8.25,-10.738; 72 8.75,-10.738; 109 8.75,10.738; 110 8.25,10.738; 111 7.75,10.738; 112 7.25,10.738; 113 6.75,10.738; 114 6.25,10.738; 115 5.75,10.738; 116 5.25,10.738; 117 4.75,10.738; 118 4.25,10.738; 119 3.75,10.738; 120 3.25,10.738; 121 2.75,10.738; 122 2.25,10.738; 123 1.75,10.738; 124 1.25,10.738; 125 0.75,10.738; 126 0.25,10.738; 127 -0.25,10.738; 128 -0.75,10.738; 129 -1.25,10.738; 130 -1.75,10.738; 131 -2.25,10.738; 132 -2.75,10.738; 133 -3.25,10.738; 134 -3.75,10.738; 135 -4.25,10.738; 136 -4.75,10.738; 137 -5.25,10.738; 138 -5.75,10.738; 139 -6.25,10.738; 140 -6.75,10.738; 141 -7.25,10.738; 142 -7.75,10.738; 143 -8.25,10.738; 144 -8.75,10.738
SON127P800X600X80-9N = smd 0.95 x 0.45: 1 -3.9,1.905; 2 -3.9,0.635; 3 -3.9,-0.635; 4 -3.9,-1.905; 5 3.9,-1.905; 6 3.9,-0.635; 7 3.9,0.635; 8 3.9,1.905 | smd 3.5 x 4.4: 9 0,0
SOP50P490X110-10N = smd 1.4 x 0.3: 1 -2.2,1; 2 -2.2,0.5; 3 -2.2,0; 4 -2.2,-0.5; 5 -2.2,-1; 6 2.2,-1; 7 2.2,-0.5; 8 2.2,0; 9 2.2,0.5; 10 2.2,1
LI10 = drill 1.321 octagon: A -2.54,-5.08; E 2.54,-5.08; S 0,5.08
NX3225GD = smd 1.5 x 2.7: P$1 -0.95,0; P$2 0.95,0

### Placement (x,y rotation side)
C1-0C  34.29,51.44 180 top
C1-2C  14.61,43.81 270 top
C1-C  86.36,85.09 90 top
C1-Y1C  24.13,46.35 180 top
C2-0C  33.02,44.45 180 top
C2-Y1C  24.13,43.81 180 top
C3-0C  41.91,35.56 180 top
C4-0C  48.26,33.02 270 top
C5-0C  55.24,33.02 270 top
C6-0C  66.04,45.72 180 top
C7-0C  66.04,51.44 180 top
C8-0C  68.58,59.82 0 top
C9-0C  53.34,66.04 90 top
C10-0C  41.91,66.04 90 top
C11-0C  48.26,66.04 90 top
C12-0C  62.87,37.47 0 top
C13-0C  75.56,81.28 90 top
C14-0C  34.29,57.15 180 top
C15-0C  7.62,15.24 180 top
C16-0C  62.87,34.92 0 top
C17-0C  68.58,57.78 0 top
D0A-C  11.43,3.81 180 top
D0B-C  13.97,3.81 180 top
D0C-C  16.51,3.81 180 top
D1-LS1C  19.63,84.43 90 top
D1A-C  24.77,3.81 180 top
D1B-C  22.23,3.81 180 top
D2A-C  30.48,3.81 180 top
D2B-C  33.02,3.81 180 top
D3-C  38.73,3.81 180 top
D4-C  44.45,3.81 180 top
D5-C  50.16,3.81 180 top
D6-C  55.88,3.81 180 top
FB1-0C  34.29,41.91 0 top
J1-C  96.52,82.55 270 top
J1-CP  22.23,20.32 180 top
J1-CS  81.92,50.8 0 bottom
J2-C  99.95,36.32 0 top
J2-CP  7.62,62.23 270 top
J2-CS  36.83,20.32 180 bottom
J3-CP  7.62,49.53 270 top
J3-CS  69.85,20.32 180 bottom
JP-CP  71.12,83.82 90 top
JP-CS  80.01,83.82 90 bottom
LS1-C  18.41,93.34 270 top
Q1-LS1C  28.57,95.89 180 top
R0-0C  85.09,15.24 0 top
R0A-C  11.43,8.26 270 top
R0B-C  13.97,8.26 270 top
R0C-C  16.51,8.26 270 top
R1-0C  45.09,66.04 90 top
R1-2C  17.01,43.81 90 top
R1-J1C  90.17,78.74 180 top
R1-J2C  88.27,37.27 270 top
R1-LS1C  15.24,84.45 0 top
R1A-C  24.77,8.26 270 top
R1B-C  22.23,8.26 270 top
R2-2C  19.41,43.81 90 top
R2-J1C  90.17,76.2 180 top
R2-J2C  90.81,37.27 90 top
R2-LS1C  31.75,95.89 90 top
R2A-C  30.48,8.26 270 top
R2B-C  33.02,8.26 270 top
R3-2C  20.95,52.07 180 top
R3-C  38.73,8.26 270 top
R3-J1C  92.71,83.82 180 top
R3-J2C  85.72,37.27 270 top
R3-LS1C  34.29,92.08 270 top
R4-2C  17.14,55.24 270 top
R4-C  44.45,8.26 270 top
R4-J1C  92.71,86.36 180 top
R5-C  50.16,8.26 270 top
R6-C  55.88,8.26 270 top
S0-0C  93.34,17.14 0 top
S1-0C  7.62,22.86 270 top
U0-C  50.8,50.8 0 top
U1-C  58.82,71.75 90 top
U2-C  16.51,49.58 270 top
VR1-LS1C  29.21,85.72 90 top
Y1-C  28.57,45.09 90 top

### Tracks (layer width: path | path; a pad name or v marks a point on that pad's centre or on a via)
3V3  (via drill 0.35, 0.85)
  Top 0.254: C5-0C.1 54.55,34.66 U0-C.62 | U0-C.17 35.35,51.55 C1-0C.1 | C11-0C.1 48.55,64.8 U0-C.131 | J1-C.4 89.22,81.28 C1-C.1 | U0-C.6 35.34,57.05 C14-0C.1 | U0-C.39 43.05,35.75 C3-0C.1 | U2-C.8 16.51,46.35 14.92,44.77 C1-2C.1 | C8-0C.1 67.36,59.55 U0-C.108 | U0-C.121 53.55,64.88 C9-0C.1 | U0-C.144 42.05,63.36 | 42.05,63.36 42.05,64.95 C10-0C.1 | U0-C.143 42.55,62.86 42.05,63.36 | C4-0C.1 49.55,35.26 U0-C.52 | U0-C.72 59.55,38.24 60.33,37.47 C12-0C.1 | C7-0C.1 65.38,53.05 U0-C.95 | U0-C.84 65.16,47.55 C6-0C.1 | FB1-0C.1 33.44,41.49 v34.29,40.64 | U1-C.7 58.19,76.6 v58.42,76.83 | U0-C.30 34.57,45.05 C2-0C.1
  Top 0.381: v63.12,60.58 66.87,60.58 C8-0C.1
  Top 1.016: v85.72,36.2 R3-J2C.2
  Top 2.032: v37.47,58.42 35.56,60.33 v30.48,60.33
  Bottom 0.254: C12-0C.1 58.42,33.97
  Bottom 0.381: 43.59,58.01 44,58.42 60.96,58.42 v63.12,60.58
  Bottom 0.508: S0-0C.1 90.09,23.57 87,26.67
  Bottom 1.016: C1-C.1 80.96,78.74 JP-CS.1 76.2,78.74 | 76.2,78.74 75.56,78.74 | 75.56,78.74 JP-CP.1 60.33,78.74 v58.42,76.83 53.66,72.07 48.26,66.67 C11-0C.1 47.71,64.54 47.46,64.54 46.85,63.93 46.85,63.07 47.46,62.46 | 75.56,78.74 C13-0C.1 | 87.63,26.04 87,26.67 85.72,27.94 v85.72,36.2 | v85.72,36.2 74.3,36.2 66.99,43.5 C6-0C.1 C7-0C.1 | 76.2,78.74 85.72,69.22 v85.72,36.2 | 47.46,62.46 48.32,62.46 50,64.14 52.38,64.14 C9-0C.1 | 47.46,62.46 44.54,62.46 C10-0C.1 39.21,62.39 | 39.21,62.39 36.67,59.85 | 36.67,59.85 35.24,58.42 C14-0C.1 C1-0C.1 33.02,49.22 33.02,46.67 33.97,45.72 C2-0C.1 | v19.41,42.87 v17.01,42.87 16.5,42.87 C1-2C.1 14.61,46.56 12.93,48.24 12.93,53.32 14.76,55.14 16.09,55.14 R4-2C.1 21.27,60.33 v30.48,60.33 | 58.42,33.97 C5-0C.1 C4-0C.1 46.67,35.56 C3-0C.1 42.86,40.64 | 36.67,59.85 37.47,59.05 v37.47,58.42 | 42.86,40.64 42.86,54.09 43.59,54.82 43.59,58.01 39.21,62.39 | v34.29,40.64 42.86,40.64
  other vias: 86.36,84.14 75.56,80.33 66.99,51.44 48.26,65.09 41.91,65.09 35.24,57.15 17.14,56.2 17.14,56.2 14.61,44.77 42.86,35.56 48.26,33.97 55.24,33.97 61.91,37.47 35.24,51.44 66.99,45.72 53.34,65.09 33.97,44.45
  pour Bottom (no thermals): 50.67,77.85 52.83,80.01 73.66,80.01 74.3,80.64 76.74,80.64 77.47,80.01 81.41,80.01 86.49,85.09 88.27,85.09 88.27,26.04 87.84,25.53 83.31,25.53 66.42,42.42 66.29,51.44 66.67,52.07 67.31,52.07 67.94,51.44 73.66,51.44 80.64,58.42 80.64,67.94 70.23,77.85
  pour Bottom (no thermals): 50.67,77.85 50.67,69.72 46.35,65.41 41.53,65.41 33.15,57.02 33.15,50.29 32.38,49.53 32.38,46.35 33.02,45.72 33.02,43.81 34.92,43.81 38.1,46.99 39.37,46.99 33.34,40.96 34.29,40.01 37.47,40.01 44.45,33.02 59.69,33.02 63.5,36.83 63.5,52.7 60.96,50.16 53.98,50.16 50.8,53.34 50.8,57.15 52.7,59.05 54.61,59.05 57.78,62.23 57.78,73.66 61.98,77.85 61.72,78.11 50.93,78.11
  pour Bottom (no thermals): 31.75,59.69 31.75,71.12 27.3,71.12 10.16,53.98 10.16,48.51 16.26,42.42 19.56,42.42 19.81,42.67 19.81,43.05 19.43,43.43 17.53,43.43 15.11,45.85 15.11,46.74 13.46,48.39 13.46,53.21 14.99,54.74 26.8,54.74
5V  (via drill 0.35)
  Top 0.508: v55.24,81.28 40.64,81.28 36.2,81.28 VR1-LS1C.A 21.93,83.19 D1-LS1C.A
  Bottom 0.381: JP-CP.2 JP-CS.2
  Bottom 0.508: JP-CP.2 v55.24,81.28
ACCEL_ANALOG  (via drill 0.35)
  Top 0.254: U0-C.46 46.55,42.74 55.1,51.29 v55.1,51.58 | v66.06,64.75 66.06,84.48 69.22,87.63 73.66,87.63 74.93,88.9 JP-CS.5
  Bottom 0.254: v66.06,64.75 65.47,64.16 65.13,64.16 64.75,63.77 64.75,61.23 v55.1,51.58
ADC-ERROR
  Top 0.254: R6-C.1 53.05,12.04 U0-C.59
ADC_ALERT  (via drill 0.35)
  Top 0.254: U2-C.2 17.01,54.16 R4-2C.2 25.14,54.3 26.79,52.64 30.86,52.64 v31.11,52.39 | U0-C.98 55.82,54.55 v55.24,53.98 | v32.38,55.24 v38.1,55.24 | v42.55,56.52 v52.7,56.52
  Bottom 0.254: v31.11,52.39 31.11,53.98 v32.38,55.24 | v38.1,55.24 39.39,56.54 42.54,56.54 v42.55,56.52 | v52.7,56.52 v55.24,53.98
ADDR
  Top 0.254: U2-C.1 17.8,52.07 R3-2C.2
ARMED-LED
  Top 0.254: U0-C.53 50.05,13.97 49.41,13.34 20.32,13.34 16.51,9.53 R0C-C.1 R0B-C.1 R0A-C.1
BATT_MEAS  (via drill 0.35)
  Top 0.254: U0-C.47 47.05,42.6 v56.52,52.07 | v65.41,63.5 65.41,84.45 69.85,88.9 JP-CP.5
  Bottom 0.254: v56.52,52.07 65.41,60.96 v65.41,63.5
BOOT0
  Top 0.254: U0-C.138 45.05,65.06 R1-0C.1
BUZZER_OUT  (via drill 0.35)
  Top 0.254: U0-C.1 38.88,59.55 31.75,66.67 v31.75,74.93 | v31.75,96.83 29.68,96.83 Q1-LS1C.1
  Bottom 0.508: v31.75,96.83 v31.75,74.93
CENTRAL-ERROR
  Top 0.254: U0-C.55 51.05,13.59 49.53,12.06 35.56,12.06 33.02,9.53 R2B-C.1 R2A-C.1
CENTRAL-NOMINAL
  Top 0.254: U0-C.54 50.55,13.72 49.53,12.7 28.26,12.7 R1A-C.1 R1B-C.1
CLK-1
  Top 0.254: U0-C.41 44.05,31.75 44.05,31.35 44.05,25 43.18,24.13 35.56,24.13 J2-CS.1
CLK-3  (via drill 0.35)
  Top 0.254: U0-C.111 58.55,66.43 v58.8,66.67 | v59.45,74.44 U1-C.6
  Bottom 0.254: v59.45,74.44 58.8,73.78 v58.8,66.67
CS1
  Top 0.254: U0-C.44 45.55,31.11 45.55,30.95 45.55,24.59 43.18,22.23 41.27,22.23 J2-CS.4
CS2
  Top 0.254: J2-CS.5 46.05,24.46 U0-C.45
CS-3
  Top 0.254: U1-C.1 56.91,66.99 57.05,66.86 U0-C.114
CTS
  Top 0.254: U0-C.34 38.73,43.05 38.6,43.05 36.83,41.27 36.83,37.47 22.23,22.86 20.32,22.86 18.41,20.95 J1-CP.4
D1-LS1C_R1-LS1C
  Top 0.508: D1-LS1C.C 16.21,84.43 R1-LS1C.2
D+
  Top 0.254: U0-C.104 64.81,57.55 66.01,56.35 83.23,56.35 85.72,53.85 85.72,40.52 | R2-J2C.2 90.11,38.22 88.96,39.37 86.87,39.37 85.72,40.52 | 85.72,40.52 R3-J2C.1
D+_R2-J1C
  Top 0.254: R2-J2C.1 J2-C.3
D-
  Top 0.254: U0-C.103 64.73,57.05 65.84,55.94 83.06,55.94 85.09,53.91 85.09,39.43 84.65,38.99 84.65,37.46 84.81,37.29 87.29,37.29 R1-J2C.2
D-_R1-J1C
  Top 0.254: J2-C.2 92.08,36.97 91.75,37.29 89.19,37.29 R1-J2C.1
DISARM_INPUT
  Top 0.254: S0-0C.3 86.4,14.88 R0-0C.2 81.28,20 81.28,41.91 73.14,50.05 U0-C.89
DROGUE-LED
  Top 0.254: R3-C.1 40.96,11.43 49.53,11.43 51.55,13.45 U0-C.56
FIRE_A
  Top 0.254: J2-CP.1 9.53,64.14 9.53,62.87 10.16,62.23 19.68,62.23 27.36,54.55 U0-C.11
FIRE_B
  Top 0.254: J2-CP.2 9.53,61.59 19.68,61.59 27.23,54.05 U0-C.12
FIRE_C
  Top 0.254: U0-C.13 27.09,53.55 19.68,60.96 J2-CP.3
FIRE_D
  Top 0.254: U0-C.14 26.96,53.05 19.68,60.33 9.53,60.33 J2-CP.4
GND  (via drill 0.35, 0.85)
  Top 0.254: C15-0C.2 5.36,16.55 S1-0C.4 S1-0C.3 5.36,33.62 v14.61,42.87 | U0-C.94 64.08,52.55 v65.09,51.55 C7-0C.2 | C17-0C.2 70.48,57.78 v71.75,59.05 70.99,59.82 C8-0C.2 | U0-C.16 36.42,52.05 36.01,52.46 34.37,52.46 C1-0C.2 v31.75,51.44 | U0-C.130 49.05,64.08 49.29,64.32 49.29,65.96 C11-0C.2 | U0-C.38 42.55,37.15 C3-0C.2 v39.37,35.56 | U0-C.31 37.13,44.55 35.77,43.18 33.02,43.18 32.07,44.13 C2-0C.2 | U0-C.61 54.05,33.27 C5-0C.2 v55.24,30.48 | C1-Y1C.2 v21.59,46.35 | C2-Y1C.2 v21.59,43.81 | R3-2C.1 v23.5,52.07 | C16-0C.2 v65.41,34.92 | U0-C.107 65.88,59.05 v66.04,58.89 | C14-0C.2 v31.75,57.15 | v48.26,30.48 C4-0C.2 48.26,32.17 47.23,33.2 47.23,34.74 49.05,36.55 U0-C.51 | R1-0C.2 v45.09,68.58 | U0-C.120 54.05,64 54.37,64.32 54.37,65.96 C9-0C.2 | C10-0C.2 v41.91,68.58 | R0-0C.1 v81.92,15.24 | D6-C.C 53.76,2.76 | 53.76,2.76 53.34,2.76 | 53.34,2.76 52.92,2.76 | 52.92,2.76 D5-C.C D4-C.C D3-C.C 35.98,2.76 | 35.98,2.76 35.56,2.76 | 35.56,2.76 35.15,2.76 | 35.15,2.76 D2B-C.C D2A-C.C D1A-C.C D1B-C.C 19.46,2.76 | 19.46,2.76 19.05,2.76 | 19.05,2.76 18.64,2.76 | 18.64,2.76 D0C-C.C D0B-C.C D0A-C.C | C12-0C.2 v65.41,37.47 | R3-LS1C.1 34.15,92.88 | U0-C.83 64.08,47.05 65.09,46.03 C6-0C.2 | U2-C.3 16.51,52.7 v15.24,53.98 | U1-C.8 56.91,82.29 v56.95,82.32 | J2-C.5 v93.98,35.01 | 19.05,2.76 v19.05,3.17 | v19.05,3.17 18.64,2.76 | v19.05,3.17 19.46,2.76 | 35.56,2.76 v35.56,3.17 | v35.56,3.17 35.98,2.76 | v35.56,3.17 35.15,2.76 | 53.34,2.76 v53.34,3.17 | v53.34,3.17 52.92,2.76 | v53.34,3.17 53.76,2.76
  Top 0.381: C9-0C.2 C11-0C.2 v48.26,68.58
  Top 0.508: Q1-LS1C.3 31.6,94.78 R2-LS1C.1 | R2-LS1C.1 32.9,94.94 v34.29,96.33 | R3-LS1C.1 32.38,94.94 R2-LS1C.1
  Top 2.032: v63.5,76.2 v63.5,83.82
  Bottom 0.254: 93.85,29.34 93.98,29.48 v93.98,35.01 | v48.26,68.58 48.26,82.28 48.3,82.32
  Bottom 1.016: 60.96,30.48 v55.24,30.48 50.8,30.48 | 60.96,30.48 v65.41,34.92 v65.41,37.47 65.09,37.78 C6-0C.2 v65.09,51.55 65.09,57.94 v66.04,58.89 71.59,58.89 v71.75,59.05 74.93,62.23 74.93,66.04 64.77,76.2 v63.5,76.2 | 50.8,30.48 v48.26,30.48 44.45,30.48 v39.37,35.56 | 79.33,22.5 80.16,21.67 80.16,16.99 v81.92,15.24 | 60.96,30.48 68.94,22.5 79.33,22.5 | J2-C.S2 J2-C.S1 | J2-C.S1 93.85,29.34 | 87.01,22.5 79.33,22.5 | J2-C.S1 J2-C.S4 J2-C.S3 | 75.56,83.82 JP-CS.3 82.55,83.82 | 75.56,83.82 JP-CP.3 | 75.56,83.82 C13-0C.2 | v48.26,68.58 v45.09,68.58 v41.91,68.58 41.91,67.31 v31.75,57.15 26.67,52.07 v23.5,52.07 | v31.75,51.44 31.63,51.44 31.55,51.35 24.21,51.35 v23.5,52.07 | v23.5,52.07 23.5,48.26 v21.59,46.35 v21.59,43.81 20.58,42.81 | v34.29,96.33 48.3,82.32 v56.95,82.32 58.45,83.82 v63.5,83.82 64.14,83.82 | v23.5,52.07 17.14,52.07 v15.24,53.98 | v14.61,42.87 14.85,42.87 16.02,41.7 19.9,41.7 20.58,42.38 20.58,42.81 | 20.58,42.81 22.34,41.06 28.68,41.06 | 50.8,30.48 50.8,3.17 v35.56,3.17 v19.05,3.17 | 30.09,41.06 28.68,41.06 | C2-0C.2 28.68,41.06 | C1-C.2 84.77,86.04 82.55,83.82 | J1-C.1 93.98,88.9 90.17,92.71 86.36,92.71 82.55,88.9 82.55,83.82
  other vias: 75.56,82.23 75.56,82.23 65.09,45.72 86.36,86.04 32.07,44.45
  pour Bottom (no thermals): 61.35,76.45 66.67,71.12 66.67,60.33 64.14,57.78 64.14,26.67 76.2,14.61 84.45,14.61 99.06,29.21 100.97,29.21 100.97,44.45 95.89,44.45 88.9,37.47 88.9,26.04 87.63,24.77 83.19,24.77 65.79,42.04 65.79,53.85 68.58,56.52 71.12,56.52 76.2,61.59 76.2,67.94 66.55,77.47 62.23,77.47
  pour Bottom (no thermals): 41.27,89.53 41.27,80.01 32.38,71.12 32.38,59.69 27.05,54.36 15.11,54.36 14.61,53.85 14.61,53.34 16.51,51.44 20.32,51.44 20.32,47.62 16.51,47.62 15.49,46.61 15.49,45.97 17.65,43.81 19.68,43.81 20.32,43.18 20.32,42.55 19.68,41.91 16.13,41.91 13.97,44.07 13.59,44.07 10.16,40.64 10.16,34.29 13.34,31.11 13.34,3.17 15.24,1.27 57.78,1.27 57.78,10.79 61.59,14.61 76.2,14.61 76.2,15.88 64.77,27.3 64.77,33.66 64.14,34.29 62.23,34.29 60.33,32.38 44.45,32.38 37.47,39.37 31.11,39.37 30.48,40.01 31.11,40.64 31.75,40.64 32.38,41.27 32.38,45.72 31.75,46.35 31.75,49.53 32.38,50.16 32.38,52.07 30.48,52.07 30.48,55.24 41.91,66.67 46.35,66.67 47.62,67.94 48.26,67.94 50.16,69.85 50.16,78.74 53.98,82.55 46.99,89.53
  pour Bottom (no thermals): 34.29,96.77 92.46,96.77 99.69,89.53 99.69,45.09 100.33,44.45 93.34,37.47 88.9,37.47 88.9,85.72 86.61,85.72 83.44,82.55 78.74,82.55 77.22,82.55 76.58,81.92 74.3,81.92 73.66,82.55 57.78,82.55 57.15,81.92 53.34,81.92 46.35,88.9 41.91,88.9 34.67,96.14 34.67,96.39
HOLD
  Top 0.254: U0-C.116 56.05,66.59 55.22,67.42 55.22,72.5 56.5,73.78 59.81,73.78 60.73,74.69 U1-C.5
ID
  Top 0.254: U0-C.102 64.66,56.55 65.67,55.54 82.89,55.54 84.45,53.98 84.45,39.37 84.24,39.16 84.24,35.96 84.81,35.39 91.72,35.39 92,35.67 J2-C.4
J1-C_R1-J1C
  Top 0.254: R1-J1C.1 J1-C.5
J1-C_R2-J1C
  Top 0.254: R2-J1C.1 J1-C.6
J1-C_R3-J1C
  Top 0.254: R3-J1C.1 J1-C.3
J1-C_R4-J1C
  Top 0.254: R4-J1C.1 J1-C.2
LS1-C_Q1-LS1C
  Top 0.254: 27.45,97.16 Q1-LS1C.2
  Top 0.508: 27.45,97.16 LS1-C.V- 14.29,93.03 R1-LS1C.1
MAIN-LED
  Top 0.254: U0-C.57 52.05,13.31 49.53,10.79 46.99,10.79 46.35,10.79 46.04,10.79 R4-C.1
MASTER_RX-1
  Top 0.254: J1-CS.1 83.19,52.7 81.84,54.05 U0-C.97
MASTER_RX-2
  Top 0.254: U0-C.37 42.05,38.88 41.27,38.1 39.37,38.1 23.5,22.23 J1-CP.2
MASTER_TX-1
  Top 0.254: U0-C.96 71.12,53.55 71.31,53.55 79.8,53.55 80.64,52.7 J1-CS.2
MASTER_TX-2
  Top 0.254: U0-C.36 38.88,42.05 38.1,41.27 38.1,37.47 J1-CP.3
MISO-1
  Top 0.254: J2-CS.2 37.47,23.5 43.18,23.5 44.55,24.86 U0-C.42
MISO-3
  Top 0.254: U1-C.2 58.19,66.99 58.05,66.86 U0-C.112
MOSI-1
  Top 0.254: J2-CS.3 39.37,22.86 43.18,22.86 45.05,24.73 U0-C.43
MOSI-3
  Top 0.254: U0-C.113 57.55,68.34 57.81,68.61 59.97,68.61 U1-C.4
N$1  (via drill 3 pad 4)
  other vias: 5.08,5.08
N$3  (via drill 3 pad 4)
  other vias: 5.08,96.52
N$4  (via drill 3 pad 4)
  other vias: 96.52,96.52
N$5  (via drill 3 pad 4)
  other vias: 96.52,5.08
NRST  (via drill 0.35)
  Top 0.254: C15-0C.1 9.88,16.55 S1-0C.2 S1-0C.1 | v38.1,46.35 39.05,47.3 39.05,47.32 39.28,47.55 U0-C.25 50.13,47.55 55.31,52.73 58.44,52.73 v59.05,53.34 | R2-J1C.2 86.36,76.2 78.11,67.94 v78.11,58.42 | v68.58,54.71 v63.5,54.71
  Bottom 0.254: v78.11,58.42 74.3,58.42 70.58,54.71 v68.58,54.71 | v59.05,53.34 60.42,54.71 v63.5,54.71 | S1-0C.1 17.86,26.11 v38.1,46.35
OSC_IN
  Top 0.254: U0-C.23 38.39,48.55 36.2,46.35 28.89,46.35 Y1-C.P$2 28.25,46.35 C1-Y1C.1
OSC_OUT
  Top 0.254: U0-C.24 38.52,48.05 36.2,45.72 31.11,45.72 29.21,43.81 28.89,43.81 Y1-C.P$1 28.25,43.81 C2-Y1C.1
R0A-C_D0A-C
  Top 0.254: R0A-C.2 D0A-C.A
R0B-C_D0B-C
  Top 0.254: R0B-C.2 D0B-C.A
R0C-C_D0C-C
  Top 0.254: R0C-C.2 D0C-C.A
R1A-C_D1A-C
  Top 0.254: R1A-C.2 D1A-C.A
R1B-C_D1B-C
  Top 0.254: R1B-C.2 D1B-C.A
R2-LS1C_LS1C
  Top 0.508: LS1-C.V+ 20.32,89.53 VR1-LS1C.S
R2A-C_D2A-C
  Top 0.254: R2A-C.2 D2A-C.A
R2B-C_D2B-C
  Top 0.254: R2B-C.2 D2B-C.A
R3-C_D3-C
  Top 0.254: R3-C.2 D3-C.A
R4-C_D4-C
  Top 0.254: R4-C.2 D4-C.A
R5-C_D5-C
  Top 0.254: R5-C.2 D5-C.A
R6-C_D6-C
  Top 0.254: R6-C.2 D6-C.A
RTS
  Top 0.254: U0-C.35 38.73,42.55 37.47,41.27 37.47,37.47 22.23,22.23 20.32,22.23 19.68,21.59 19.68,19.05 20.32,18.41 24.13,18.41 J1-CP.1
SCL-1  (via drill 0.35)
  Top 0.254: R2-2C.2 19.1,44.77 17.51,46.35 U2-C.10 17.51,47.84 17.78,48.11 18.63,48.11 19.13,47.6 20.3,47.6 20.8,48.11 34.44,48.11 v34.92,47.62 | v41.91,55.88 42.24,55.55 U0-C.100
  Bottom 0.254: v41.91,55.88 34.92,48.9 v34.92,47.62
SDA-1  (via drill 0.35)
  Top 0.254: R1-2C.2 U2-C.9 17.01,48.13 17.4,48.51 18.8,48.51 19.3,48.01 20.12,48.01 20.62,48.51 35.94,48.51 v36.2,48.26 | v41.91,54.61 42.35,55.05 U0-C.99
  Bottom 0.254: v41.91,54.61 36.2,48.9 v36.2,48.26
SENSE_A  (via drill 0.35)
  Top 0.254: U2-C.4 16.01,50.99 16.86,50.14 19.43,50.14 | v13.97,50.39 13.74,50.16 10.79,50.16 J3-CP.1 | 19.43,50.14 19.94,50.14 | 19.94,50.14 36.7,50.14 37.61,51.05 U0-C.18 | 19.94,50.14 v19.68,50.39 19.43,50.14
  Bottom 0.254: v13.97,50.39 v19.68,50.39
SENSE_B
  Top 0.254: U0-C.19 37.79,50.55 36.97,49.73 16.64,49.73 | 16.64,49.73 15.51,50.91 | U2-C.5 15.51,50.91 | 16.64,49.73 14.35,49.73 | 14.35,49.73 8.69,49.73 J3-CP.2 | 15.51,50.91 14.35,49.75 14.35,49.73
  pour Top: 14.38,49.73 16.64,49.73 15.51,50.91
SENSE_C
  Top 0.254: U0-C.20 37.86,50.05 37.14,49.33 16.64,49.33 | 16.64,49.33 15.51,48.2 | U2-C.6 15.51,48.2 | J3-CP.3 8.69,49.33 14.38,49.33 | 14.38,49.33 16.64,49.33 | 15.51,48.2 14.38,49.33
  pour Top: 14.38,49.33 16.64,49.33 15.51,48.2
SENSE_D  (via drill 0.35)
  Top 0.254: U0-C.21 37.94,49.55 37.31,48.92 19.96,48.92 | U2-C.7 16.01,48.13 16.8,48.92 19.05,48.92 19.46,48.92 | 19.46,48.92 19.68,48.92 | 19.68,48.92 19.96,48.92 | 19.68,48.92 19.71,48.9 v19.71,48.67 | v13.97,48.67 13.74,48.9 10.79,48.9 J3-CP.4 | v19.71,48.67 19.96,48.92 | v19.71,48.67 19.46,48.92
  Bottom 0.254: v13.97,48.67 v19.71,48.67
SENSOR-ERROR
  Top 0.254: U0-C.64 55.55,36.03 56.68,34.9 56.68,26.67 56.68,26.5 56.68,25.23 59.69,22.23 61.59,22.23 J3-CS.2
SENSOR-NOMINAL
  Top 0.254: U0-C.63 55.05,35.96 56.27,34.74 56.27,26.67 56.27,26.28 56.27,25.01 J3-CS.1
STORAGE-ERROR
  Top 0.254: R5-C.1 50.16,10.16 50.16,10.47 50.16,10.79 52.55,13.18 U0-C.58
SWCLK  (via drill 0.35)
  Top 0.254: U0-C.109 60.24,62.23 64.77,62.23 65.17,62.23 66.67,62.23 83.19,78.74 83.19,87.63 84.45,88.9 v86.36,88.9 | v88.9,86.36 R4-J1C.2
  Bottom 0.254: v88.9,86.36 v86.36,88.9
SWDIO
  Top 0.254: U0-C.105 64.88,58.05 66.18,56.76 75.17,56.76 77.47,59.05 77.47,67.94 87,77.47 97.48,77.47 98.32,78.31 98.32,81.71 97.48,82.55 92.71,82.55 91.76,83.5 R3-J1C.2
SWO  (via drill 0.35)
  Top 0.254: R1-J1C.2 84.45,78.74 67.29,61.57 63.52,61.57 63.5,61.59 v63.5,61.57 | U0-C.133 47.55,60.4 48.26,59.69 v59.69,59.69
  Bottom 0.254: v59.69,59.69 61.57,61.57 v63.5,61.57
U1S-CHECK
  Top 0.254: U0-C.65 56.05,36.11 57.09,35.07 57.09,25.46 59.69,22.86 63.5,22.86 J3-CS.3
U2S-CHECK
  Top 0.254: U0-C.66 56.55,36.18 57.49,35.24 57.49,25.69 59.69,23.5 65.41,23.5 J3-CS.4
U2S-ST
  Top 0.254: U0-C.69 58.05,36.41 58.71,35.75 58.71,27.94 58.71,27.65 58.71,26.38 59.69,25.4 71.12,25.4 J3-CS.7
U3S-CHECK
  Top 0.254: U0-C.67 57.05,36.26 57.9,35.41 57.9,27.3 57.9,27.19 57.9,25.92 59.69,24.13 67.31,24.13 J3-CS.5
U4S-CHECK
  Top 0.254: U0-C.68 57.55,36.33 58.31,35.58 58.31,26.15 59.69,24.77 69.22,24.77 J3-CS.6
US2-STATUS
  Top 0.254: U0-C.70 58.55,36.48 59.12,35.91 59.12,26.61 59.69,26.04 73.03,26.04 J3-CS.8
VCAP_1
  Top 0.254: U0-C.71 59.05,36.83 60.96,34.92 C16-0C.1
VCAP_2
  Top 0.254: U0-C.106 65.28,58.55 66.04,57.78 C17-0C.1
VDDA
  Top 0.254: FB1-0C.2 36.78,43.55 | 36.78,43.55 U0-C.33 | U0-C.32 37.28,44.05 36.78,43.55
VR1-LS1C_R3-LS1C
  Top 0.254: 34.29,90.81 R3-LS1C.2
  Top 0.508: VR1-LS1C.E 34.29,90.81
VUSB  (via drill 0.35)
  Top 0.254: J2-C.1 93.82,37.62 86.36,45.09 86.36,60.33 v79.38,67.31 | JP-CP.4 71.12,86.06 69.32,84.25 69.32,77.37 v74.3,72.39
  Bottom 0.254: v79.38,67.31 v74.3,72.39
WP  (via drill 0.35)
  Top 0.254: U0-C.115 56.55,66.78 56.28,67.05 56.28,68.34 57.2,69.27 v59.45,69.27
  Bottom 0.254: v59.45,67.86 v59.45,69.27

### Text on the board
tNames: Purdue Space Program Solids / SRAD CPr Prototype 1.0 | 1 | 1 | 2 | 3 | 4 | 5 | 6 | SWD | GND | 1 | 1 | SWCLK | 2 | SWDIO | 3 | 3V3 | 4 | SWO | 5 | NRST | 6 | MBATISTICH JKAJI MPARAL | UART-2 Test | SPI-1 Test | MISO-1 | MOSI-1 | TX-2 | RX-2 | CLK-1 | RTS | CS1 | CS2 | CTS | ARMED | C Nominal | C Error | Drogue Chute | Main Chute | Storage Error | ADC Error
bNames: Purdue Space Program Solids / SRAD CPr Prototype 1.0 | MBATISTICH JKAJI MPARAL